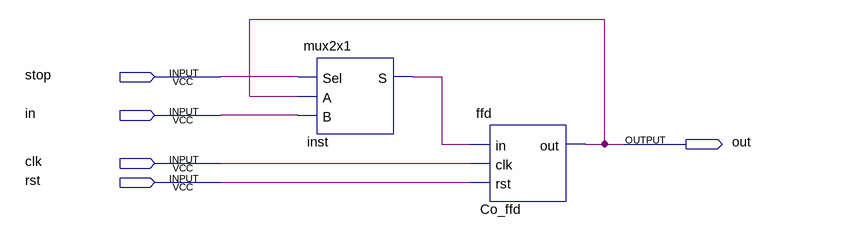
[diagram p0: schematic sheet]
// Quartus schematic synccounter_base.bdf as structural Verilog: 2 symbols, 5 pins
module synccounter_base (
  input  stop,
  input  in,
  input  clk,
  input  rst,
  output out
);

  wire inst_s;

  mux2x1 inst (.Sel(stop), .A(out), .B(in), .S(inst_s));
  ffd Co_ffd (.in(inst_s), .clk(clk), .rst(rst), .out(out));
endmodule
